# Altium project TempRatorLm35_7Segmaent.PrjPcb
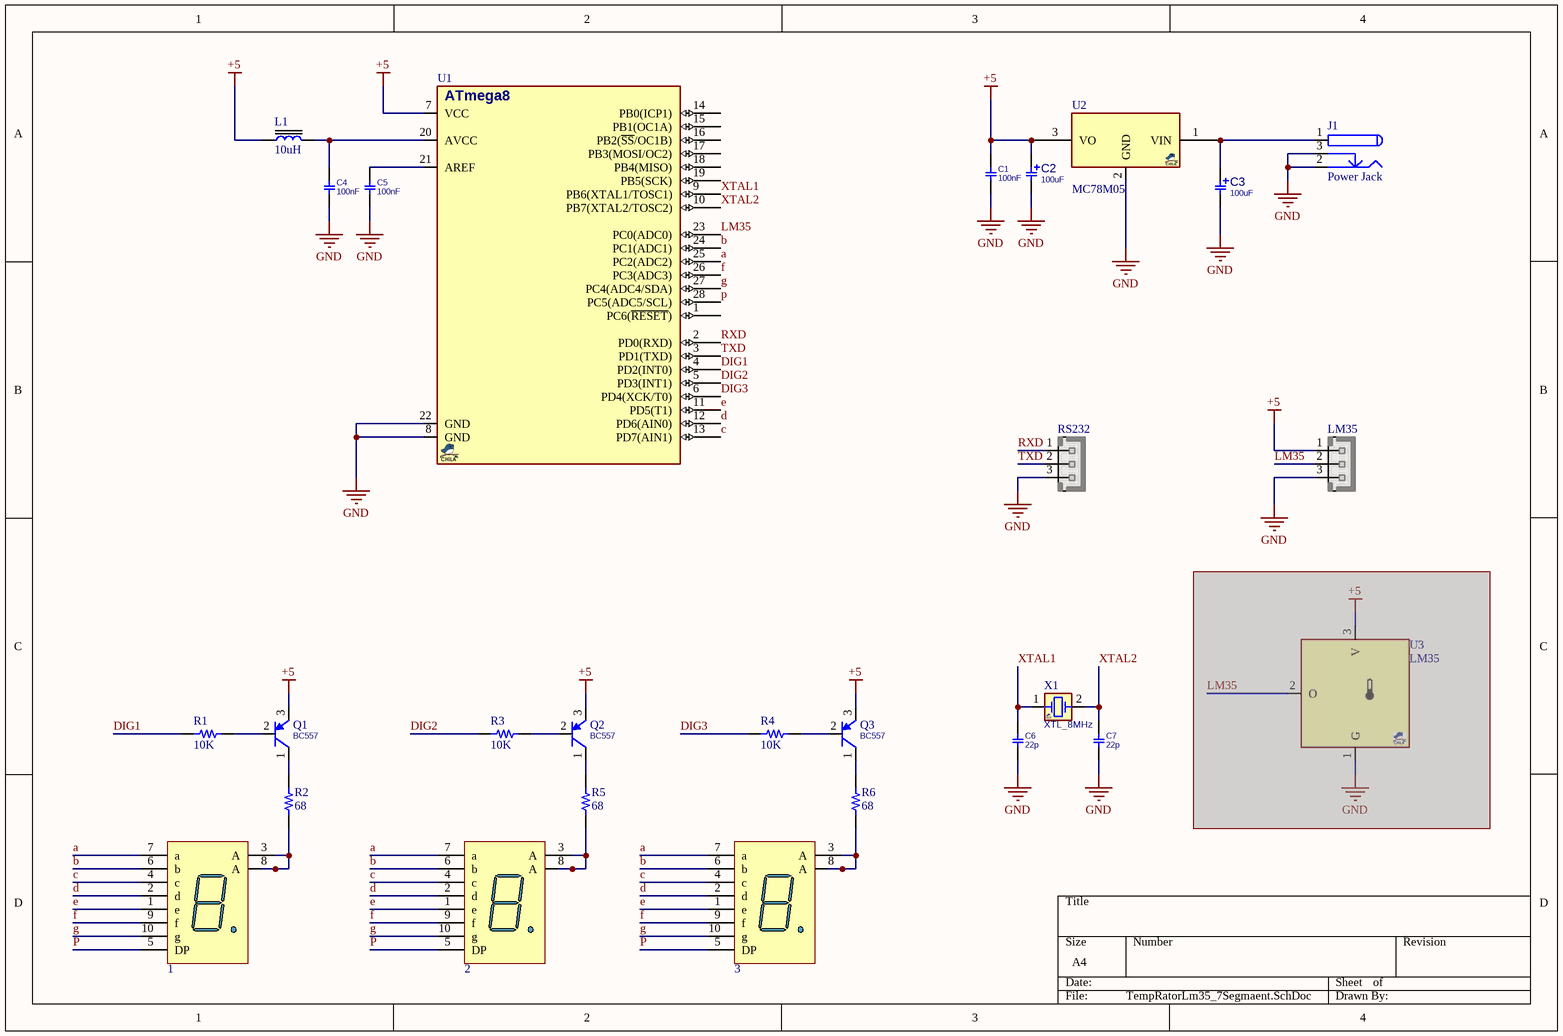
[diagram p0: TempRatorLm35_7Segmaent.SchDoc]
1 sheet, 27 parts. Net scope: global (net labels, ports and power ports of the same name join across sheets).
Board files: TempRatorLm35_7Segmaent.PcbDoc, EMBDDED_TempRatorLm35_7Segmaent.PcbDoc

## Sheet TempRatorLm35_7Segmaent.SchDoc
size A4; SheetNumber: 1; SheetTotal: 1

### Parts
1  7segment_CA  [7segment_CA]  (value not drawn)
2  7segment_CA  [7segment_CA]  (value not drawn)
3  7segment_CA  [7segment_CA]  (value not drawn)
C1  100nF  [C_CER_D3]
C2  100uF  [C_EL_5X7]
C3  100uF  [C_EL_5X7]
C4  100nF  [C_CER_D3]
C5  100nF  [C_CER_D3]
C6  22p  [C_CER_D3]
C7  22p  [C_CER_D3]
J1  Power Jack  [Power Jack]
L1  value 10uH  [10uH INDUTOR_THT_15.2mm]  (hidden comment: 10uH INDUTOR_THT_15.2mm)
LM35  HHDR_3  [XH_3]  (value not drawn)
Q1  BC557  [TO92_3]
Q2  BC557  [TO92_3]
Q3  BC557  [TO92_3]
R1  value 10K  [R10K_RES_THD_AX14_0.25W]  (hidden comment: R10K_RES_THD_0.25W_1-8mm)
R2  value 68  [R68_RES_THD_AX14_0.25W]  (hidden comment: R68_RES_THD_0.25W_1-8mm)
R3  value 10K  [R10K_RES_THD_AX14_0.25W]  (hidden comment: R10K_RES_THD_0.25W_1-8mm)
R4  value 10K  [R10K_RES_THD_AX14_0.25W]  (hidden comment: R10K_RES_THD_0.25W_1-8mm)
R5  value 68  [R68_RES_THD_AX14_0.25W]  (hidden comment: R68_RES_THD_0.25W_1-8mm)
R6  value 68  [R68_RES_THD_AX14_0.25W]  (hidden comment: R68_RES_THD_0.25W_1-8mm)
RS232  HHDR_3  [XH_3]  (value not drawn)
U1  ATMEGA8  [DIP_28]  (value not drawn)
U2  MC78M05  [TO220_3]
U3  LM35  [TO92_3]  (masked out: inside a compile mask, not in the netlist)
X1  XTL_8MHz  [XTLT_2]

### Nets
+5: C1.2 C2.1 L1.1 LM35.1 Q1.3(E) Q2.3(E) Q3.3(E) U1.7(VCC) U2.3(VO)
GND: C1.1 C2.2 C3.2 C4.1 C5.1 C6.2 C7.2 J1.2 J1.3 LM35.3 RS232.3 U1.8(GND) U1.22(GND) U2.2(GND)
a: 1.7(a) 2.7(a) 3.7(a) U1.25(PC2(ADC2))
b: 1.6(b) 2.6(b) 3.6(b) U1.24(PC1(ADC1))
c: 1.4(c) 2.4(c) 3.4(c) U1.13(PD7(AIN1))
d: 1.2(d) 2.2(d) 3.2(d) U1.12(PD6(AIN0))
DIG1: R1.1 U1.4(PD2(INT0))
DIG2: R3.1 U1.5(PD3(INT1))
DIG3: R4.1 U1.6(PD4(XCK/T0))
e: 1.1(e) 2.1(e) 3.1(e) U1.11(PD5(T1))
f: 1.9(f) 2.9(f) 3.9(f) U1.26(PC3(ADC3))
g: 1.10(g) 2.10(g) 3.10(g) U1.27(PC4(ADC4/SDA))
LM35: LM35.2 U1.23(PC0(ADC0))
P: 1.5(DP) 2.5(DP) 3.5(DP) U1.28(PC5(ADC5/SCL))
RXD: RS232.1 U1.2(PD0(RXD))
TXD: RS232.2 U1.3(PD1(TXD))
XTAL1: C6.1 U1.9(PB6(XTAL1/TOSC1)) X1.1(OSC1)
XTAL2: C7.1 U1.10(PB7(XTAL2/TOSC2)) X1.2(OSC2)
Net1_3: 1.3(A) 1.8(A) R2.1
Net2_3: 2.3(A) 2.8(A) R5.1
Net3_3: 3.3(A) 3.8(A) R6.1
NetC3_1: C3.1 J1.1 U2.1(VIN)
NetC4_2: C4.2 L1.2 U1.20(AVCC)
NetC5_2: C5.2 U1.21(AREF)
NetQ1_1: Q1.1(C) R2.2
NetQ1_2: Q1.2(B) R1.2
NetQ2_1: Q2.1(C) R5.2
NetQ2_2: Q2.2(B) R3.2
NetQ3_1: Q3.1(C) R6.2
NetQ3_2: Q3.2(B) R4.2

Not connected (* = marked no-connect by the designer): U1 1(PC6(~{RESET})) 14(PB0(ICP1)) 15(PB1(OC1A)) 16(PB2(~{SS}/OC1B)) 17(PB3(MOSI/OC2)) 18(PB4(MISO)) 19(PB5(SCK))

### Notes on the sheet
- (in symbol ATMEGA8_DIP28) ATmega8

### Library data of the parts
C1 C4-C7 = CAP_THD_CERML: CAP, THD, CER MULTI LAYER,; PARAM: 50V; DESC: CAP, CER MULTI LAYER,; MANF_P#: MANF_PART#; PRICE: 100= 1$; MANF: MANF; PARAM2: PARAM2; ASSEMBLY: ASSEMBLY
  C1 C4 C5: VALUE: 100nF
  C6 C7: VALUE: 22p
C2 C3 = CAP_THD_EL: CAP, THD, ELEC,; MANF_P#: MANF_PART#; PARAM2: 20%; DESC: DESCRIPTION; DIST#: MOUSER; PARAM: 25V; PRICE: 10= 5$; MANF: MANF; ASSEMBLY: ASSEMBLY; VALUE: 100uF
L1 = 10uH INDUTOR_THT_15.2mm: 10uH INDUTOR THT LENGTH 15.2mm; Type: 10%; Package: THT
LM35 RS232 = XH_3: JST-XH pitch: 2.5mm; VALUE: HHDR_3
Q1-Q3 = PNP_BC557_TO92: BJT, PNP, 45v, 0.1A, THD, TO92; PARAM2: 500mW; MANF: MULTICOMP; PARAM: 45v, 0.1A; MANF_P#: BC557; VALUE: BC557
R1 R3 R4 = R10K_RES_THD_0.25W_1-8mm: RESISTOR_10KOhm_THD_0.25W-8mm; Pacakge: THT; Rating: 0.25W; Type: 5%
R2 R5 R6 = R68_RES_THD_0.25W_1-8mm: RESISTOR_68Ohm_THD_0.25W-8mm; Pacakge: THT; Rating: 0.25W; Type: 5%; Parameter 1: *
U1 = ATMEGA8_DIP28: MCU, AVR, 8-Bit, 8KB, 1KB RAM, 16MHz; PART#ALT: ATmega8-48-88-168-328; MANF_P#: ATMEGA8-16PU; DESC: 512B EEPROM; MANF: ATMEL/MICROCHIP; PARAM2: 4.5~5.5V; PARAM: 8KB, 1KB RAM, 16MHz, -40~85°C; PRICE: 2.5$; VALUE: ATMEGA8
U2 = VREG_78M05_TO220: REG, Linear, Fixed, 5v, 1.5A, TO-220; MANF_P#: LM78M05CT, LM7805CT, LM7805ACT, UA7805CKC, L7805ABV, L7805ACV, L7805CV, L78M05CV, KA78T05, KA7805ETU, MC78M05BT, MC78M05CT, MC7805ACT, MC7805ABT, NCP7805TG, NJM7805FA, TS7805CZ; MANF: TI, ST, FAIRCHILD, ON, NJR, TS; PARAM: 5v, 1.5A; PARAM2: PARAM2; VALUE: MC78M05
U3 = TMP_LM35_TO92: SENSOR, TEMP, ANALOG, -55~150oC, 4~20Vcc, Out 0mV + 10mV/oC; MANF_P#: LM35CZ, LM35CAZ or LM35DZ; MANF: TI; PARAM: 0.5°C Accuracy, 10mV/oC, -55~150oC; PARAM2: 4~20Vcc; PRICE: 7$; VALUE: LM35
X1 = XTL_2_HC49_8MHz_THD: Crystal MOST POPULAR ABL HC49 PACKAGE; MANF: ABRACON; MANF_P#: ABLS-8.000MHZ-B4-T; PARAM: 8MHz, 18pF, 30PPM, -20~70oC; PRICE: 0.3$; VALUE: XTL_8MHz
1-3 = 7segment_CA: LatestRevisionDate: 17-Jul-2002; LatestRevisionNote: Re-released for DXP Platform.; Publisher: Altium Limited